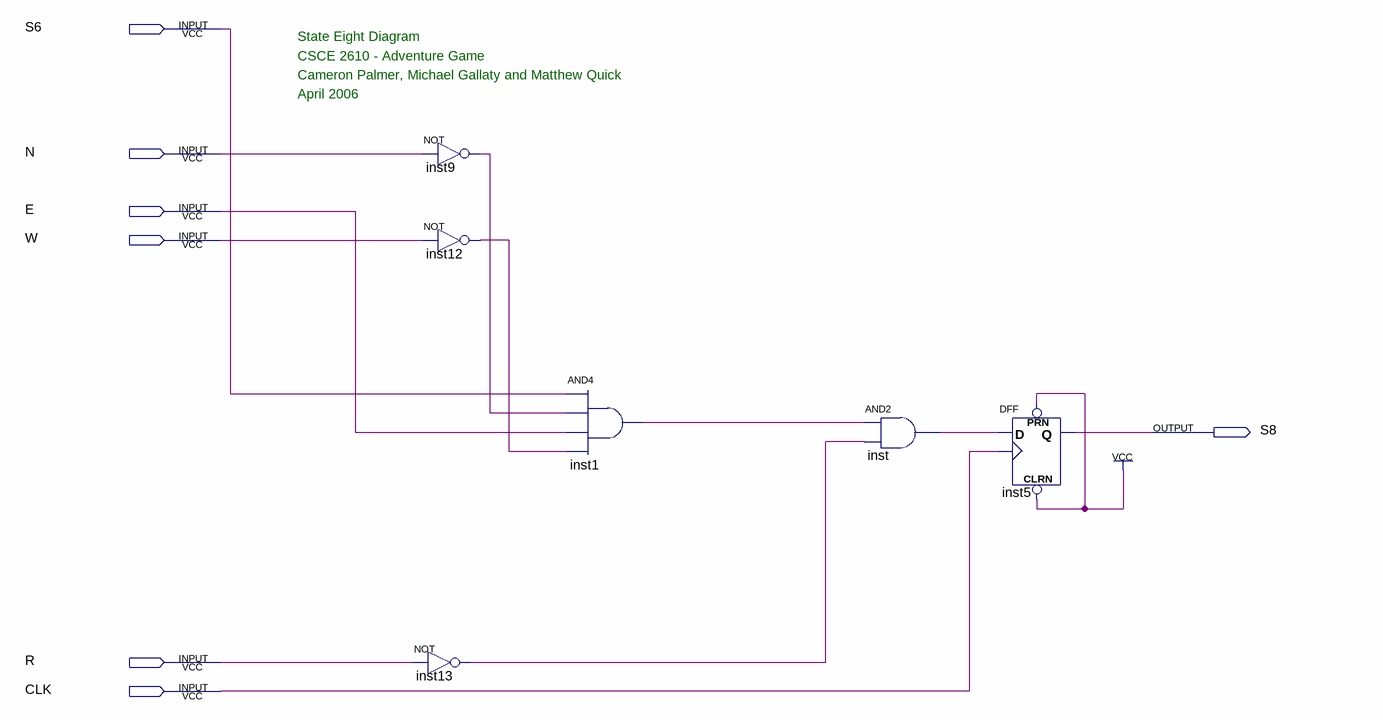
[diagram p0: schematic sheet]
// Quartus schematic state_eight.bdf as structural Verilog: 6 symbols, 7 pins
module state_eight (
  input  S6,
  input  N,
  input  E,
  input  W,
  input  R,
  input  CLK,
  output S8
);

  wire inst1_out, inst9_out, inst12_out, inst13_out, inst_out;

  not inst9 (inst9_out, N);
  not inst12 (inst12_out, W);
  not inst13 (inst13_out, R);
  and inst1 (inst1_out, S6, inst9_out, E, inst12_out);
  and inst (inst_out, inst1_out, inst13_out);
  DFF inst5 (.CLRN(1'b1), .CLK(CLK), .D(inst_out), .PRN(1'b1), .Q(S8));

  // Notes on the sheet:
  //   State Eight Diagram
  //   CSCE 2610 - Adventure Game
  //   Cameron Palmer, Michael Gallaty and Matthew Quick
  //   April 2006
endmodule
